# Altium project ATTITUDE.PrjPcb
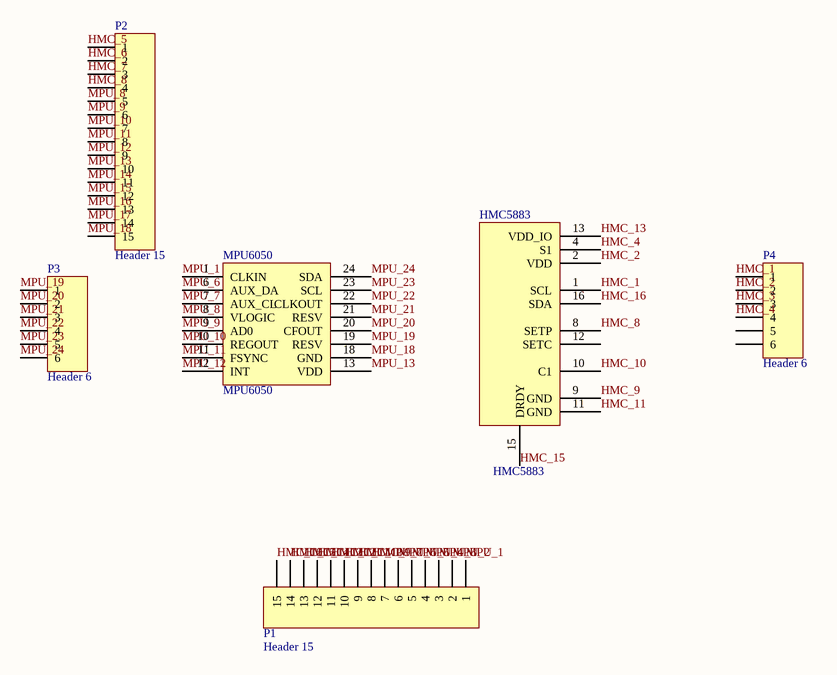
[diagram p0: ATTITUDE.SchDoc]
1 sheet, 6 parts. Net scope: global (net labels, ports and power ports of the same name join across sheets).
Board file: ATTITUDE.PcbDoc

## Sheet ATTITUDE.SchDoc
size A4

### Parts
HMC5883  HMC5883  [HMC5883]
MPU6050  MPU6050  [MPU6050]
P1  Header 15  [HDR1X15]
P2  Header 15  [HDR1X15]
P3  Header 6  [HDR1X6]
P4  Header 6  [HDR1X6]

### Nets
HMC_1: HMC5883.1(SCL) P4.1
HMC_2: HMC5883.2(VDD) P4.2
HMC_3: P4.3
HMC_4: HMC5883.4(S1) P4.4
HMC_5: P2.1
HMC_6: P2.2
HMC_7: P2.3
HMC_8: HMC5883.8(SETP) P2.4
HMC_9: HMC5883.9(GND) P1.8
HMC_10: HMC5883.10(C1) P1.9
HMC_11: HMC5883.11(GND) P1.10
HMC_12: P1.11
HMC_13: HMC5883.13(VDD_IO) P1.12
HMC_14: P1.13
HMC_15: HMC5883.15(DRDY) P1.14
HMC_16: HMC5883.16(SDA) P1.15
MPU_1: MPU6050.1(CLKIN) P1.1
MPU_2: P1.2
MPU_3: P1.3
MPU_4: P1.4
MPU_5: P1.5
MPU_6: MPU6050.6(AUX_DA) P1.6
MPU_7: MPU6050.7(AUX_CL) P1.7
MPU_8: MPU6050.8(VLOGIC) P2.5
MPU_9: MPU6050.9(AD0) P2.6
MPU_10: MPU6050.10(REGOUT) P2.7
MPU_11: MPU6050.11(FSYNC) P2.8
MPU_12: MPU6050.12(INT) P2.9
MPU_13: MPU6050.13(VDD) P2.10
MPU_14: P2.11
MPU_15: P2.12
MPU_16: P2.13
MPU_17: P2.14
MPU_18: MPU6050.18(GND) P2.15
MPU_19: MPU6050.19(RESV) P3.1
MPU_20: MPU6050.20(CFOUT) P3.2
MPU_21: MPU6050.21(RESV) P3.3
MPU_22: MPU6050.22(CLKOUT) P3.4
MPU_23: MPU6050.23(SCL) P3.5
MPU_24: MPU6050.24(SDA) P3.6

Not connected (* = marked no-connect by the designer): HMC5883 12(SETC); P4 5 6

### Library data of the parts
HMC5883 MPU6050 = Component_1
P1 P2 = Header 15: Header, 15-Pin; LatestRevisionDate: 17-Jul-2002; LatestRevisionNote: Re-released for DXP Platform.; Publisher: Altium Limited
P3 P4 = Header 6: Header, 6-Pin; LatestRevisionDate: 17-Jul-2002; LatestRevisionNote: Re-released for DXP Platform.; Publisher: Altium Limited